# Altium project SmartCubeExtension.PrjPcb
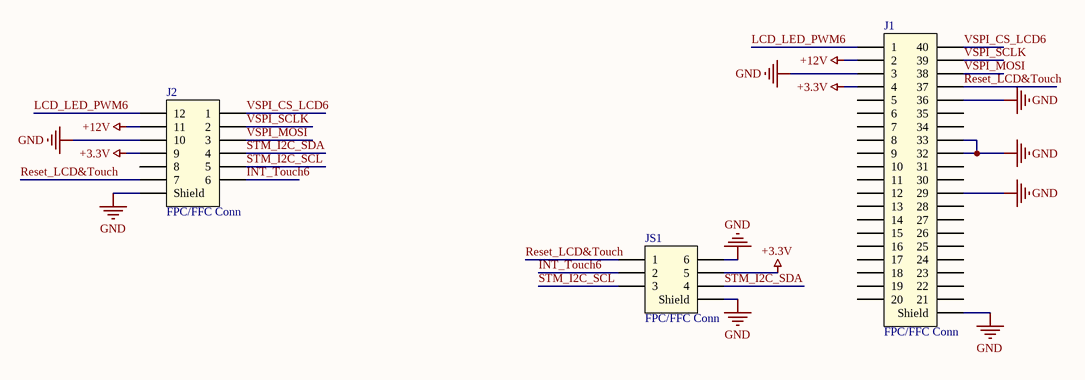
[diagram p0: SmartCubeExtension.SchDoc]
1 sheet, 3 parts. Net scope: global (net labels, ports and power ports of the same name join across sheets).
Board file: SmartCubeExtension.PcbDoc

## Sheet SmartCubeExtension.SchDoc
size A4

### Parts
J1  FPC/FFC Conn  [FH12-40S Vertical]
J2  FPC/FFC Conn  [FH12-12S Vertical]
JS1  FPC/FFC Conn  [FH12-6s Vertical]

### Nets
+3.3V: J1.4 J2.9 JS1.5
+12V: J1.2 J2.11
GND: J1.3 J1.29 J1.32 J1.33 J1.36 J1.A(Shield) J2.10 J2.A(Shield) JS1.6 JS1.A(Shield)
INT_Touch6: J2.6 JS1.2
LCD_LED_PWM6: J1.1 J2.12
Reset_LCD&Touch: J1.37 J2.7 JS1.1
STM_I2C_SCL: J2.5 JS1.3
STM_I2C_SDA: J2.4 JS1.4
VSPI_CS_LCD6: J1.40 J2.1
VSPI_MOSI: J1.38 J2.3
VSPI_SCLK: J1.39 J2.2

Not connected (* = marked no-connect by the designer): J1 5 6 7 8 9 10 11 12 13 14 15 16 17 18 19 20 21 22 23 24 25 26 27 28 30 31 34 35; J2 8

### Library data of the parts
J1 = Conn40x1 (FH12 Vertical): Connector to Display's trail; Part Number: FH12-40S-0.5SVA(54); Manufacturer: Hirose Electric; Type: Connector; ComponentLink1Description: Chip&Dip; ComponentLink1URL: https://www.chipdip.ru/product1/8002082143
J2 = Conn12x1 (FH12 Vertical): Connector to trail; Part Number: FH12-12S-0.5SVA(54); Manufacturer: Hirose Electric; Type: Connector; ComponentLink1Description: Mouser; ComponentLink1URL: https://ru.mouser.com/ProductDetail/Hirose-Connector/FH12-12S-05SVA54?qs=%2Fha2pyFadugx2rsdyHDVcXwbI8krQaq6%252BPNTW5YGSdYzC8JBsy5pU75ViyDjvRCP
JS1 = Conn6x1 (FH12 Vertical): Connector to touch sensor's trail; Part Number: FH12-6S-0.5SVA(54); Manufacturer: Hirose Electric; Type: Connector; ComponentLink1Description: Mouser; ComponentLink1URL: https://ru.mouser.com/ProductDetail/Hirose-Connector/FH12-6S-05SVA54?qs=%2Fha2pyFaduhYbZFVunKSgIpYMlkzngMoGcACEbztduQ1P2V6tcZCQQ%3D%3D